# EAGLE board 2d (EAGLE 6.4)
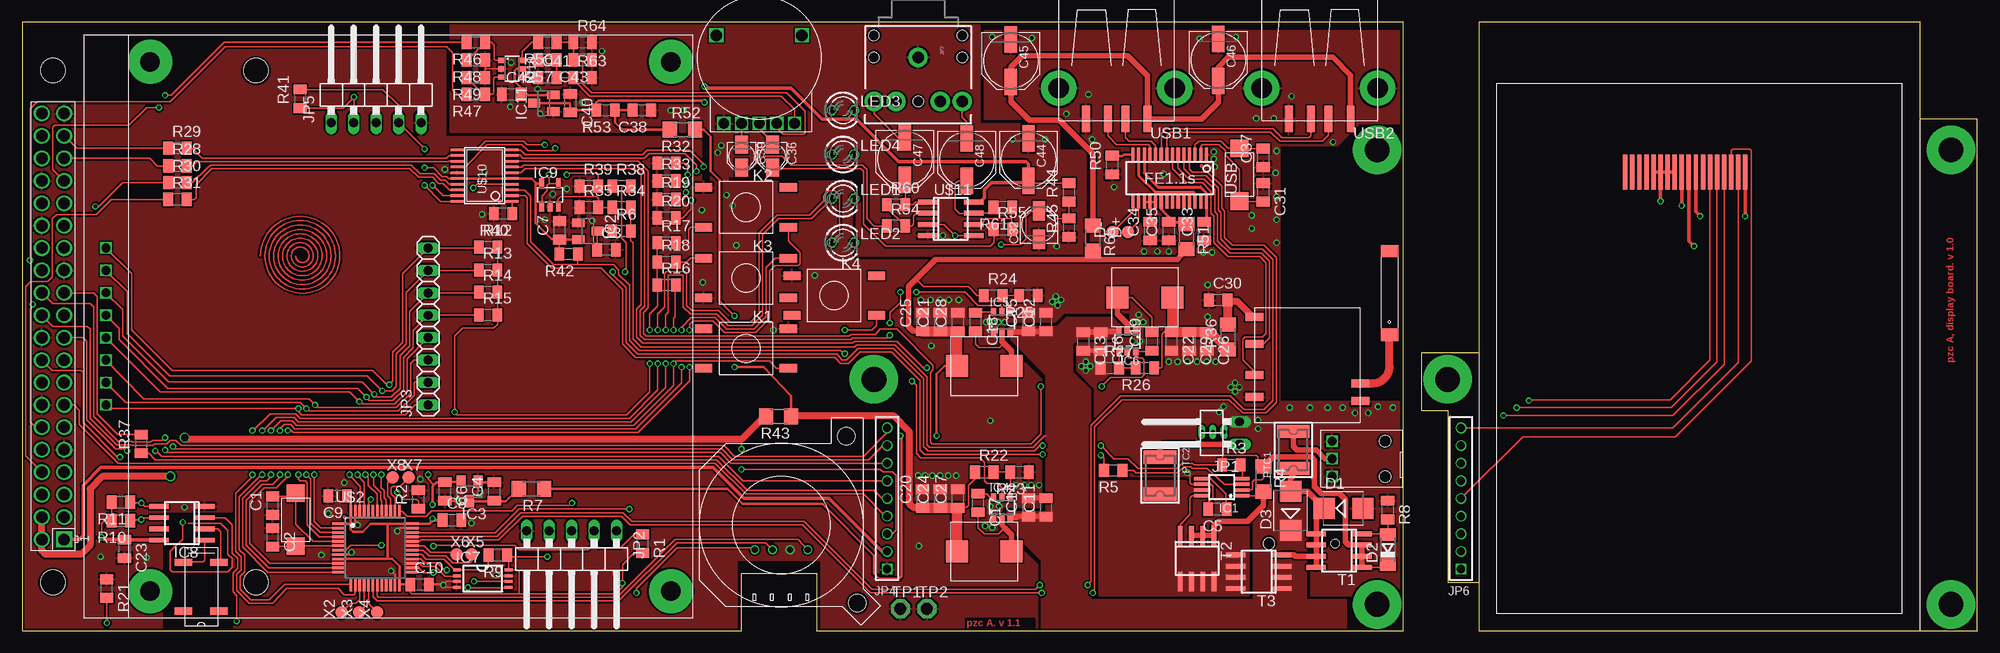
[diagram p1: board, top side]
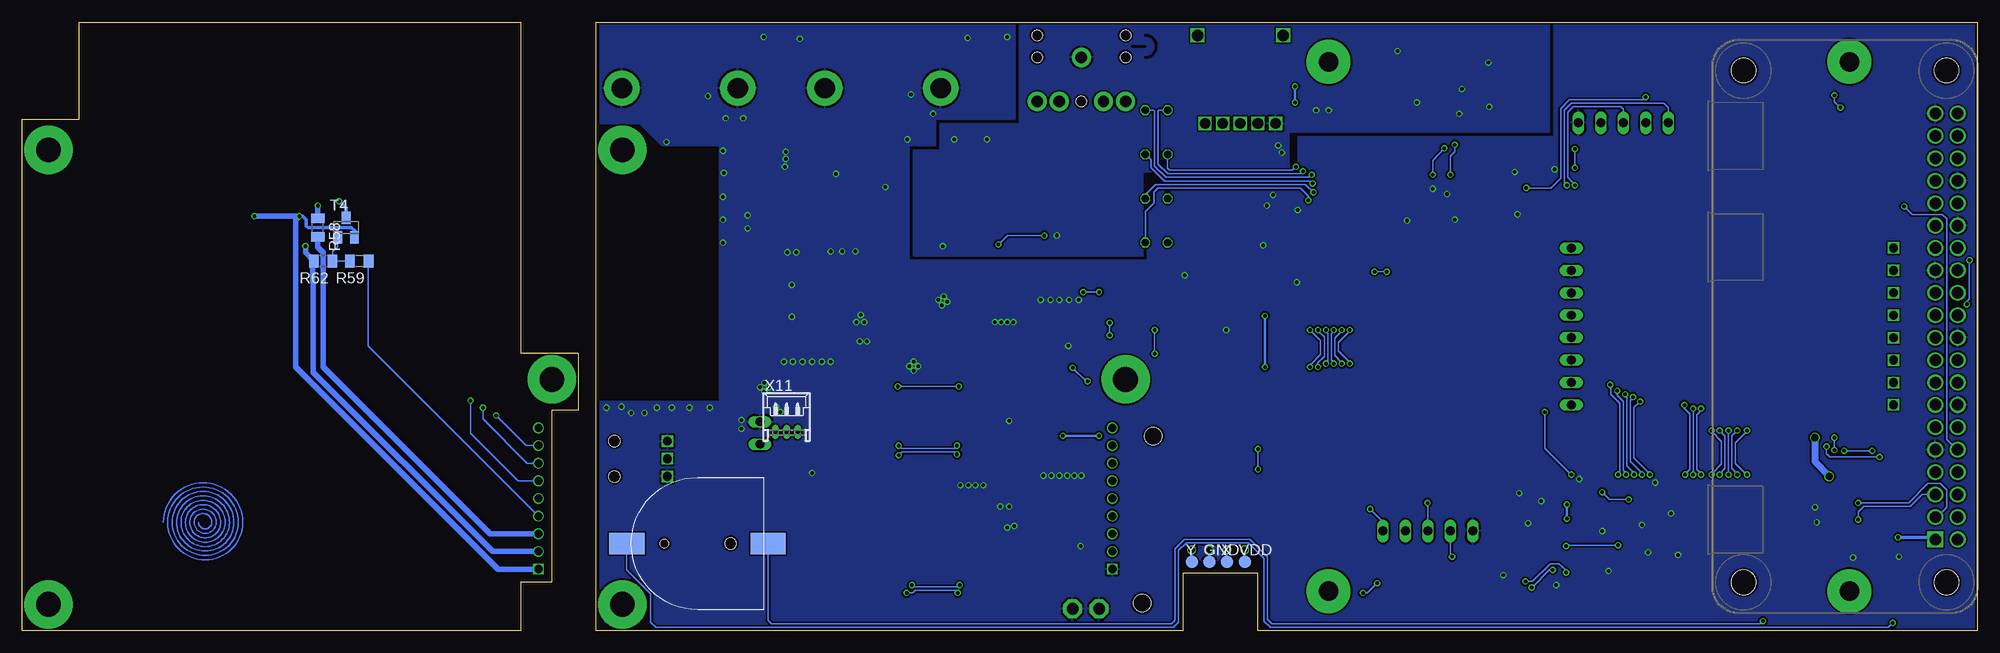
[diagram p2: board, bottom side, seen from below]

Size 221.5 x 69 mm. Coordinates in mm from the lower left corner, seen from the top.
Outline: 0,0 81.5,0 81.5,6.5 90,6.5 90,0 156.5,0 156.5,69 0,69 0,0
Outline: 161.5,5.5 165,5.5 165,0 221.5,0 221.5,58 215,58 215,69 165,69 165,31.5 158.5,31.5 158.5,25 161.5,25 161.5,5.5
Copper layers (1*16): Top 0.035mm / dielectric 1.5mm / Bottom 0.035mm
Design rules "ch_6": minimum track width 0.15mm, minimum drill 0.4mm, track to track 0.2mm, track to pad 0.2mm, pad to pad 0.2mm, via to via 0.2mm, smd to smd 0.2mm, copper to edge 10mil, drill to drill 8mil, minimum pad ring 0.15mm, minimum via ring 0.15mm, stop-mask expansion 4mil, vias tented up to drill 0mil, thermal gap 10mil
bRestrict: 2 lines

## Footprints (pad centres in the part's own frame; a part is rotated, then mirrored left to right if it is on the bottom)
ANT_RAINSUN-24G = smd 2 x 1.4: 1 0,-4.75; 2 0,4.75
R0805 = smd 1.1 x 1.5: 1 -1.05,0; 2 1.05,0
PANASONIC_B = smd 2.2 x 1.4: + 1.6,0; - -1.6,0
PANASONIC_A = smd 2 x 1.5: + 1.3,0; - -1.3,0
PANASONIC_D = smd 3 x 1.4: + 2.4,0; - -2.4,0
SMB = smd 2.4 x 2.4: A 2.2,0; C -2.2,0
SOD80C = smd 1.4 x 1.8: A 1.7,0; C -1.7,0
TP14R = smd 1.4 x 1.4: TP 0,0
MSOP8 = smd 0.4 x 1.6: 1 -0.975,-2.35; 2 -0.325,-2.35; 3 0.325,-2.35; 4 0.975,-2.35; 5 0.975,2.35; 6 0.325,2.35; 7 -0.325,2.35; 8 -0.975,2.35
SOT23 = smd 1 x 1.4: 1 -0.95,-1.1; 2 0.95,-1.1; 3 0,1.1
SOT23-6 = smd 0.6 x 0.9: 1 -0.95,-1.15; 2 0,-1.15; 3 0.95,-1.15; 4 0.95,1.15; 5 0,1.15; 6 -0.95,1.15
TSSOP8W = smd 0.9 x 0.35: 1 -3.045,1.205; 2 -3.045,0.555; 3 -3.045,-0.095; 4 -3.045,-0.745; 5 2.805,-0.745; 6 2.805,-0.095; 7 2.805,0.555; 8 2.805,1.205
SO-08 = smd 0.55 x 2.2: 1 -1.905,-2.6; 2 -0.635,-2.6; 3 0.635,-2.6; 4 1.905,-2.6; 5 1.905,2.6; 6 0.635,2.6; 7 -0.635,2.6; 8 -1.905,2.6
SOT23-5L = smd 0.55 x 1.2: 1 -0.95,-1.3; 2 0,-1.3; 3 0.95,-1.3; 4 0.95,1.3; 5 -0.95,1.3
1X02/90 = drill 1 long: 1 -2.54,-3.81; 2 0,-3.81
1X05/90 = drill 1.016 long: 1 -5.08,-3.81; 2 -2.54,-3.81; 3 0,-3.81; 4 2.54,-3.81; 5 5.08,-3.81
1X08 = drill 1.016 long: 1 -8.89,0; 2 -6.35,0; 3 -3.81,0; 4 -1.27,0; 5 1.27,0; 6 3.81,0; 7 6.35,0; 8 8.89,0
1X09M = drill 0.914 square: 1 -8,0 | drill 0.914: 2 -6,0; 3 -4,0; 4 -2,0; 5 0,0; 6 2,0; 7 4,0; 8 6,0; 9 8,0
AUDIO-JACK = drill 1.3 pad 2.184: RING 5,5; RSH 5,2.5; SLEEVE 0,0; TIP 5,-5; TSH 5,-2.5 | hole 1.2: 0,5; -2.5,5; -2.5,-5; 0,-5; 5,0
SW_SMD2 = smd 1.93 x 0.965: 1A -4.8,2.25; 1B -4.8,-2.25; 2A 4.8,2.25; 2B 4.8,-2.25
LED3MM = drill 0.813 octagon: A -1.27,0; K 1.27,0
MOD_USB_RTL8188 = smd 2 x 0.9: 3V3 12,-11.98; ANT 0,-4.45; D+ 12,-5.425; D- 12,-8.9; GND 12,-2.903; RFGND 0,-2.45
PTC1812 = smd 1.5 x 3.7: P$1 -2.1,0; P$2 2.1,0
CRYST_32K_87X38MM = smd 0.8 x 2: 1 -2.75,-2; 2 2.75,-2; 3 2.75,2; 4 -2.75,2
R1206 = smd 1.6 x 1.803: 1 -1.422,0; 2 1.422,0
DISP_ILI_28 = smd 0.5 x 4: 1 -5.2,17; 2 -4.4,17; 3 -3.6,17; 4 -2.8,17; 5 -2,17; 6 -1.2,17; 7 -0.4,17; 8 0.4,17; 9 1.2,17; 10 2,17; 11 2.8,17; 12 3.6,17; 13 4.4,17; 14 5.2,17; 15 6,17; 16 6.8,17; 17 7.6,17; 18 8.4,17
P1-13 = drill 1.321 pad 2.159 octagon: TP 0,0
CON_DC13 = drill 1 square: 1 8,3.2; 2 8,1.2; 3 8,5.2 | hole 1.3: 2,5.2; 2,1.2
LQFP48 = smd 1.5 x 0.3: 1 -4.15,2.75; 2 -4.15,2.25; 3 -4.15,1.75; 4 -4.15,1.25; 5 -4.15,0.75; 6 -4.15,0.25; 7 -4.15,-0.25; 8 -4.15,-0.75; 9 -4.15,-1.25; 10 -4.15,-1.75; 11 -4.15,-2.25; 12 -4.15,-2.75; 25 4.15,-2.75; 26 4.15,-2.25; 27 4.15,-1.75; 28 4.15,-1.25; 29 4.15,-0.75; 30 4.15,-0.25; 31 4.15,0.25; 32 4.15,0.75; 33 4.15,1.25; 34 4.15,1.75; 35 4.15,2.25; 36 4.15,2.75 | smd 0.3 x 1.5: 13 -2.75,-4.15; 14 -2.25,-4.15; 15 -1.75,-4.15; 16 -1.25,-4.15; 17 -0.75,-4.15; 18 -0.25,-4.15; 19 0.25,-4.15; 20 0.75,-4.15; 21 1.25,-4.15; 22 1.75,-4.15; 23 2.25,-4.15; 24 2.75,-4.15; 37 2.75,4.15; 38 2.25,4.15; 39 1.75,4.15; 40 1.25,4.15; 41 0.75,4.15; 42 0.25,4.15; 43 -0.25,4.15; 44 -0.75,4.15; 45 -1.25,4.15; 46 -1.75,4.15; 47 -2.25,4.15; 48 -2.75,4.15
BOURNS_SRP7030 = smd 2.5 x 2.5: P$1 3.1,0; P$2 -3.1,0
BATT_HOLDER_DS1092-12 = smd 4 x 2.4: N -8,0; POS 8,0 | hole 1: -3.75,0 | hole 1.3: 3.75,0
KB1604 = drill 1 square: 1 -8.89,-2.5; 2 -6.35,-2.5; 3 -3.81,-2.5; 4 -1.27,-2.5; 5 1.27,-2.5; 6 3.81,-2.5; 7 6.35,-2.5; 8 8.89,-2.5 | drill 2.2 pad 5: P$2 -30,2.5; P$3 30,2.5; P$4 -30,61.5; P$5 30,61.5
JOY_PS = hole 2: 10.09,-7.35; -8.85,-8.61
RASPBERRYPI_BASTELSTUBE_V13_RASPI_BOARD_B+_FULL = drill 1.3 pad 1.778 square: 1 8.37,25.23 | drill 1.3 pad 1.778: 2 8.37,27.77; 3 10.91,25.23; 4 10.91,27.77; 5 13.45,25.23; 6 13.45,27.77; 7 15.99,25.23; 8 15.99,27.77; 9 18.53,25.23; 10 18.53,27.77; 11 21.07,25.23; 12 21.07,27.77; 13 23.61,25.23; 14 23.61,27.77; 15 26.15,25.23; 16 26.15,27.77; 17 28.69,25.23; 18 28.69,27.77; 19 31.23,25.23; 20 31.23,27.77; 21 33.77,25.23; 22 33.77,27.77; 23 36.31,25.23; 24 36.31,27.77; 25 38.85,25.23; 26 38.85,27.77; 27 41.39,25.23; 28 41.39,27.77; 29 43.93,25.23; 30 43.93,27.77; 31 46.47,25.23; 32 46.47,27.77; 33 49.01,25.23; 34 49.01,27.77; 35 51.55,25.23; 36 51.55,27.77; 37 54.09,25.23; 38 54.09,27.77; 39 56.63,25.23; 40 56.63,27.77 | hole 2.8: 3.5,3.5; 3.5,26.5; 61.5,3.5; 61.5,26.5
TSSOP20 = smd 0.3 x 1.5: 1 -2.925,-3.118; 2 -2.275,-3.118; 3 -1.625,-3.118; 4 -0.975,-3.118; 5 -0.325,-3.118; 6 0.325,-3.118; 7 0.975,-3.118; 8 1.625,-3.118; 9 2.275,-3.118; 10 2.925,-3.118; 11 2.925,3.118; 12 2.275,3.118; 13 1.625,3.118; 14 0.975,3.118; 15 0.325,3.118; 16 -0.325,3.118; 17 -0.975,3.118; 18 -1.625,3.118; 19 -2.275,3.118; 20 -2.925,3.118
POT_14X2DUAL = drill 1.2 square: G -4,-7.5; T1 4,-7.5; T2 2,-7.5; W1 -2,-7.5; W2 0,-7.5 | drill 1.3 square: P$1 -4.85,2.5; P$2 4.85,2.5
FE1.1S_SSOP-28 = smd 0.35 x 1.5: 1 -4.16,-2.7; 2 -3.52,-2.7; 3 -2.88,-2.7; 4 -2.24,-2.7; 5 -1.6,-2.7; 6 -0.96,-2.7; 7 -0.32,-2.7; 8 0.32,-2.7; 9 0.96,-2.7; 10 1.6,-2.7; 11 2.24,-2.7; 12 2.88,-2.7; 13 3.52,-2.7; 14 4.16,-2.7; 15 4.16,2.7; 16 3.52,2.7; 17 2.88,2.7; 18 2.24,2.7; 19 1.6,2.7; 20 0.96,2.7; 21 0.32,2.7; 22 -0.3,2.7; 23 -0.96,2.7; 24 -1.6,2.7; 25 -2.24,2.7; 26 -2.88,2.7; 27 -3.52,2.7; 28 -4.16,2.7
USB-A-S = smd 3 x 0.9: D+ 3.45,-1; D- 3.45,1; GND 3.45,-3.5; VBUS 3.45,3.5 | drill 2.3 pad 4: GND@1 0,6.566; GND@2 0,-6.566
CR_12SMXA_S = smd 2 x 2: P$1 -3,0; P$2 3,0
53048-03 = drill 0.5 pad 0.698 long: 1 1.25,-1.25; 2 0,-1.25; 3 -1.25,-1.25

## Placement (x,y rotation side)
ANT1  ANT_RAINSUN_24GHZ  [ANT_RAINSUN-24G]  154.9,38.3 0 top
C1  33  [R0805]  28.4,14.2 90 top
C2  33  [R0805]  28.4,10.6 270 top
C3  1u  [R0805]  66.2,43.2 0 top
C4  1u  [R0805]  53.5,15.8 90 top
C5  100n  [R0805]  135.4,13.8 180 top
C6  1u  [R0805]  47.9,15.8 270 top
C7  1u  [R0805]  60.9,45.4 90 top
C8  100n  [R0805]  48.7,12.55 0 top
C9  100n  [R0805]  35.75,15.3 180 top
C10  100n  [R0805]  45.05,5.25 0 top
C11  22u  [R0805]  116,14 90 top
C12  22u  [R0805]  116,35 90 top
C13  22u  [R0805]  120.2,32.8 270 top
C14  22u  [R0805]  114,14 90 top
C15  22u  [R0805]  114,35 90 top
C16  22u  [R0805]  122.2,32.8 270 top
C17  100n  [R0805]  108.3,14.5 270 top
C18  100n  [R0805]  108,35 270 top
C19  100n  [R0805]  128,32.8 90 top
C20  22u  [R0805]  102,15 90 top
C21  22u  [R0805]  104,35 90 top
C22  22u  [R0805]  130.2,32.8 270 top
C23  100n  [R0805]  11.6,9.3 270 top
C24  22u  [R0805]  104,15 90 top
C25  22u  [R0805]  102,35 90 top
C26  22u  [R0805]  134.2,32.8 270 top
C27  22u  [R0805]  106,15 90 top
C28  22u  [R0805]  106,35 90 top
C29  22u  [R0805]  132.2,32.8 270 top
C30  22u  [R0805]  135.5,37.5 0 top
C31  33  [R0805]  140.6,49.7 270 top
C32  10u  [PANASONIC_B]  115.2,46 90 top
C33  10u  [R0805]  133.9,45.3 90 top
C34  10u  [R0805]  127.8,45.3 90 top
C35  10u  [R0805]  129.9,45.3 90 top
C36  1u  [PANASONIC_A]  85,53.8 270 top
C37  33  [R0805]  140.6,53.6 90 top
C38  10u  [R0805]  70.2,59 180 top
C39  1u  [PANASONIC_A]  81.5,53.8 270 top
C40  10u  [R0805]  62.1,59.8 270 top
C41  33n  [R0805]  59.5,62.7 0 top
C42  10u  [R0805]  55.4,60.8 0 top
C43  33n  [R0805]  63.5,64.7 180 top
C44  100u  [PANASONIC_D]  114,53.4 270 top
C45  100u  [PANASONIC_D]  112,64.6 270 top
C46  100u  [PANASONIC_D]  135.5,64.7 270 top
C47  100u  [PANASONIC_D]  100,53.5 270 top
C48  100u  [PANASONIC_D]  107,53.4 270 top
D1  12V  [SMB]  149.7,13.9 0 top
D2  12V  [SOD80C]  154.7,9.2 90 top
D3  1N5818  [SMB]  143.7,13.6 90 top
D+  TPTP14R  [TP14R]  125.3,45.2 90 top
D-  TPTP14R  [TP14R]  123.5,45.2 90 top
GND  TPTP14R  [TP14R]  87,7.8 0 bottom
IC1  MCP73844  [MSOP8]  135.9,16.3 90 top
IC2  MCP1702-SOT23  [SOT23]  64.1,45.3 270 top
IC3  MCP1702-SOT23  [SOT23]  50.7,15.8 180 top
IC4  TPS562200  [SOT23-6]  111,14 0 top
IC5  TPS562200  [SOT23-6]  111,35 0 top
IC6  TPS562200  [SOT23-6]  125.2,32.8 180 top
IC7  EEPROM_SPI-TSSOP  [TSSOP8W]  52.3,5.7 0 top
IC8  PCF8523  [SO-08]  18.1,12.2 90 top
IC9  MCP6021  [SOT23-5L]  59.8,49.4 0 top
IC10  74LVC2G34  [SOT23-6]  55.5,63.7 270 top
IC11  MCP1702-SOT23  [SOT23]  59.1,59.8 90 top
JP1  [1X02/90]  134.1,23.7 90 top
JP2  [1X05/90]  62.25,7.5 180 top
JP3  [1X08]  46,34.5 90 top
JP4  [1X09M]  98,15 90 top
JP5  [1X05/90]  40.1,61.4 0 top
JP6  [1X09M]  163,15 90 top
JP7  [AUDIO-JACK]  101.5,65 270 top
K1  SWITCH_BD_B  [SW_SMD2]  82,32 180 top
K2  SWITCH_BD_B  [SW_SMD2]  82,48 180 top
K3  SWITCH_BD_B  [SW_SMD2]  82,40 180 top
K4  SWITCH_BD_B  [SW_SMD2]  92,38 180 top
LED1  [LED3MM]  93,49 0 top
LED2  [LED3MM]  93,44 0 top
LED3  [LED3MM]  93,59 0 top
LED4  [LED3MM]  93,54 0 top
MOD1  MOD_USB_RTL8188  [MOD_USB_RTL8188]  151.6,23.6 180 top
PTC1  1,1A  [PTC1812]  144,20.5 90 top
PTC2  1,1A  [PTC1812]  128.9,17.6 270 top
Q1  CRYSTAL87X38  [CRYST_32K_87X38MM]  20.3,5 270 top
R1  10k  [R0805]  70.3,9.9 270 top
R2  10k  [R0805]  44.9,14.9 90 top
R3  10k  [R0805]  137,18.8 0 top
R4  0R47  [R1206]  140.6,17.2 270 top
R5  2k7  [R0805]  123.6,18.2 180 top
R6  1R  [R0805]  67.9,45.3 0 top
R7  0R1  [R1206]  57.7,16.1 180 top
R8  2k7  [R0805]  154.7,13.7 270 top
R9  10k  [R0805]  53.9,8.6 180 top
R10  10k  [R0805]  11.2,12.5 180 top
R11  10k  [R0805]  11.2,14.6 180 top
R12  10k  [R0805]  52.8,43.5 0 top
R13  10k  [R0805]  52.8,40.9 0 top
R14  10k  [R0805]  52.8,38.4 0 top
R15  10k  [R0805]  52.8,35.8 0 top
R16  10k  [R0805]  73,39.2 0 top
R17  10k  [R0805]  73,44 0 top
R18  10k  [R0805]  73,41.8 0 top
R19  470  [R0805]  73,48.9 0 top
R20  470  [R0805]  73,46.8 0 top
R21  0R  [R0805]  9.6,4.8 270 top
R22  56k  [R0805]  109,18 0 top
R23  10k  [R0805]  113,18 180 top
R24  56k  [R0805]  110,38 0 top
R25  10k  [R0805]  114,38 180 top
R26  33k  [R0805]  127.2,29.8 180 top
R27  10k  [R0805]  123.2,29.8 0 top
R28  470  [R0805]  17.6,52.7 0 top
R29  470  [R0805]  17.6,54.7 0 top
R30  470  [R0805]  17.6,50.8 0 top
R31  470  [R0805]  17.6,48.9 0 top
R32  470  [R0805]  73,53 0 top
R33  470  [R0805]  73,51 0 top
R34  10M  [R0805]  67.9,48 0 top
R35  1M  [R0805]  64.2,48 0 top
R36  0R1  [R1206]  136.6,33.3 90 top
R37  47  [R0805]  13.5,21.2 90 top
R38  56k  [R0805]  67.9,50.4 0 top
R39  10k  [R0805]  64.2,50.4 0 top
R40  10k  [R0805]  54.5,47.3 180 top
R41  10k  [R0805]  31.5,60.3 90 top
R42  10k  [R0805]  61.9,42.7 180 top
R43  0R1  [R1206]  85.7,24.3 180 top
R44  10k  [R0805]  118.6,49.7 90 top
R45  10k  [R0805]  118.6,45.7 90 top
R46  470  [R0805]  51.4,66.7 180 top
R47  470  [R0805]  51.4,60.8 180 top
R48  10k  [R0805]  51.4,64.7 180 top
R49  10k  [R0805]  51.4,62.7 180 top
R50  2k7  [R0805]  123.5,52.8 90 top
R51  0R1  [R1206]  131.9,44.7 270 top
R52  0R1  [R1206]  74.8,56.8 0 top
R53  47R  [R0805]  66.1,59 180 top
R54  10k  [R0805]  99,45.9 0 top
R55  10k  [R0805]  111.1,45.5 0 top
R56  270  [R0805]  59.5,66.7 180 top
R57  270  [R0805]  59.5,64.7 180 top
R58  47  [R0805]  188,45.7 270 bottom
R59  270  [R0805]  183.3,41.9 180 bottom
R60  10k  [R0805]  99,48.3 0 top
R61  10k  [R0805]  111.1,48 180 top
R62  10k  [R0805]  187.4,41.9 180 bottom
R63  150  [R0805]  63.5,62.7 0 top
R64  150  [R0805]  63.5,66.7 0 top
R65  0R1  [R1206]  121.3,44.5 270 top
T1  PFET_SO8  [SO-08]  149.2,9.1 90 top
T2  PFET_SO8  [SO-08]  133.1,8.2 180 top
T3  PFET_SO8  [SO-08]  140.1,6.7 90 top
T4  BC847  [SOT23]  184.8,45.7 0 bottom
TFT1  DISP_ILI_28  [DISP_ILI_28]  190,69 180 top
TP1  PTR1PAD1-13  [P1-13]  99.5,2.5 0 top
TP2  PTR1PAD1-13  [P1-13]  102.5,2.5 0 top
U$1  CONN_DC_13  [CON_DC13]  156.4,22.7 180 top
U$2  STM32F072-LQFP48  [LQFP48]  40,9.4 0 top
U$3  2u2  [BOURNS_SRP7030]  109,9 0 top
U$4  2u2  [BOURNS_SRP7030]  109,30 0 top
U$5  2u2  [BOURNS_SRP7030]  127.2,37.8 180 top
U$6  BATTH1220  [BATT_HOLDER_DS1092-12]  145,9.9 0 bottom
U$7  KB1604  [KB1604]  12,34.5 270 top
U$8  JOY_PS  [JOY_PS]  86,12 90 top
U$9  RPI-ZERO  [RASPBERRYPI_BASTELSTUBE_V13_RASPI_BOARD_B+_FULL]  30,2 90 top
U$10  STM32F030_20  [TSSOP20]  52.4,51.6 90 top
U$11  TDA1308  [SO-08]  105.2,46.7 270 top
U$12  POT_DUAL_14X2  [POT_14X2DUAL]  83.5,65 0 top
USB  FE1.1S  [FE1.1S_SSOP-28]  130,51.3 180 top
USB1  USB-A-S  [USB-A-S]  124,61.5 270 top
USB2  USB-A-S  [USB-A-S]  147,61.5 270 top
VDD  TPTP14R  [TP14R]  83,7.8 0 bottom
X  TPTP14R  [TP14R]  85,7.8 0 bottom
X1  CRYST_TC26SMXAS  [CR_12SMXA_S]  31,12.6 270 top
X2  TPTP14R  [TP14R]  36.2,2.1 90 top
X3  TPTP14R  [TP14R]  38.2,2.1 90 top
X4  TPTP14R  [TP14R]  40.2,2.1 90 top
X5  TPTP14R  [TP14R]  50.9,8.7 0 top
X6  TPTP14R  [TP14R]  49.2,8.7 0 top
X7  TPTP14R  [TP14R]  43.8,17.4 0 top
X8  TPTP14R  [TP14R]  42,17.4 0 top
X9  CRYST_TC26SMXAS  [CR_12SMXA_S]  137.9,51.7 90 top
X11  53048-03  [53048-03]  134.9,23.8 0 bottom
Y  TPTP14R  [TP14R]  89,7.8 0 bottom

## Tracks (layer width: path | path; a pad name or v marks a point on that pad's centre or on a via)
3V3_EN  (via drill 0.4)
  Top 0.16: U$10.8 69.78,53.23 70.9,52.1 70.9,36.6 70.4,36.1 70.4,33.7 70.7,33.4 93.7,33.4 93.9,33.6 96.7,33.6 97.2,34.2 99.1,34.2 103.2,30.1 103.2,29.6 102.9,29.3 102.9,21.4 103.1,21.2 114.3,21.2 115.4,22.3 v115.4,27.7 | v122.3,27.7 123.3,28.7 126.8,28.7 127.1,29 127.1,30.7 126.9,30.9 125.4,30.9 125.2,31.1 IC6.5
  Bottom 0.16: v122.3,27.7 v115.4,27.7
3V_STB  (via drill 0.4)
  Top 0.16: 58.3,50.7 58.2,50.8 | v45.6,54.6 45.6,54.63 JP5.4 42.7,57.65 42.7,59.5 40.85,61.35 R41.2 | R42.2 60.85,44.3 C7.1 60.85,44.4 | U$10.16 48.33,51.27 48.1,51.5 47.6,51.5 46.6,52.5 v45.6,52.5
  Top 0.3: U$10.16 U$10.5 57.73,51.27 58.2,50.8 58.2,46.2 60,44.4 60.85,44.4 | IC9.5 58.3,50.7 | C7.1 IC2.2
  Bottom 0.16: v45.6,52.5 v45.6,54.6
5V0@2  (via drill 0.4, 0.8)
  Top 0.16: JP4.3 98.6,11 99,11.4 99,17.6 98.6,18 97.5,18 97.2,18.3 v81.5,18.3 | v81.5,20.6 81.5,21.7
  Top 0.8: R43.2 84.1,24.3 81.5,21.7 18.6,21.7 v18.4,21.9 | v16.8,17.5 9.1,17.5 7.7,16.1 7.7,9.7 6.7,8.7 2.6,8.7 2.2,9.1 2.2,10.34 U$9.2 U$9.4
  Bottom 0.16: v81.5,18.3 v81.5,20.6
  Bottom 0.8: v18.4,21.9 18.4,19.2 v16.8,17.5
5VM_EN  (via drill 0.4)
  Top 0.16: U$10.6 56.52,51.92 57,52.4 69.4,52.4 70.1,51.7 70.1,37 69.6,36.5 69.6,33.3 70.3,32.6 94.1,32.6 94.3,32.8 99.1,32.8 102.3,29.6 v102.5,29.8 | IC4.5 111,16.2 110.5,16.7 109.3,16.7 109,17 109,19.1 108.5,19.6 101.8,19.6 101.3,20.1 101.3,27.8 v100.8,28.3
  Bottom 0.16: v100.8,28.3 101,28.3 v102.5,29.8
5VU_EN  (via drill 0.4)
  Top 0.16: U$10.7 56.58,52.58 56.8,52.8 69.6,52.8 70.5,51.9 70.5,36.8 70,36.3 70,33.5 70.5,33 93.9,33 94.1,33.2 98,33.2 v98.3,33.5 | IC5.5 111,36.7 110.8,36.9 108.3,36.9 106.8,38.4 v101.3,38.4 | v99.5,38.4 99.5,37.2 98.3,36.1 v98.3,34.9
  Bottom 0.16: v101.3,38.4 v99.5,38.4 | v98.3,33.5 v98.3,34.9
+3V3
  Top 0.16: C22.1 129.35,33.85 129.1,33.6 129.1,29.9 129,29.8 R26.1
  Top 0.6: 130.3,33.95 C22.1 | C26.1 134.63,33.85
  Top 1: 134.63,33.85 R36.1
  Top 1.2: U$5.P$2 130.3,33.95 | C22.1 C29.1 C26.1
+5V  (via drill 0.4)
  Top 0.16: R22.1 107.95,17.25 107.2,16.5 107.2,14.2 107,14 106.05,14 C27.1
  Top 0.3: v80.7,35.7 79,37.4 79,51.1 78,52.1 78,56 77.2,56.8 R52.2 | v80.7,29.9 84,29.9 87.1,26.6 87.1,24.32 R43.1
  Top 0.6: 105.9,13.85 C27.1
  Top 0.8: R43.1 87.4,24.3 87.5,24.4 98.7,24.4 100.5,22.6 100.5,14.4 100.9,14 101.95,14 C20.1
  Top 1.2: U$3.P$2 105.9,13.85 | C27.1 C24.1 C20.1
  Bottom 0.3: v80.7,35.7 v80.7,29.9
+5V/1  (via drill 0.4)
  Top 0.16: R24.1 108.2,38 107.2,39 102.1,39 101.25,39.85
  Top 0.3: R7.1 79.9,16.1 81.6,14.4 90.7,14.4 96.5,8.5 96.5,6.5 97.1,5.9 99.3,5.9 99.6,6.2 99.6,21.9 v99.5,22.1 | v103.6,22.1 103.6,29.1 104.5,30 U$4.P$2
  Top 0.6: R65.2 121.3,42.1 | 121.3,42.1 103.5,42.1 101.25,39.85 100.4,39 100.4,34.5 100.9,34 101.95,34 C25.1 | 105.9,33.85 C28.1 | R51.2 131.88,43.28 130.9,42.1 121.3,42.1
  Top 1.2: C25.1 C21.1 C28.1 | U$4.P$2 105.9,33.85
  Bottom 0.3: v99.5,22.1 v103.6,22.1
+8V
  Top 0.16: R34.2 R6.2 68.95,44.25 69.2,44 69.2,33.4 69.2,33.1 70.1,32.2 70.4,32.2 94.3,32.2 94.5,32.4 98.9,32.4 102.5,28.8 102.5,21.1 102.8,20.8 114.5,20.8 115.8,22.1 116,22.1
  Top 0.6: IC4.3 112.65,12.85 112.8,13 113.95,13 C14.1 C11.1 | IC6.3 122.3,33.95 C16.1 C13.1 | IC5.3 113.9,33.85 C15.1 C12.1
  pour Top (no thermals): 115.5,0 150,0 150,3.5 145.5,3.5 145.5,16 139.5,16 139.5,3.5 121,3.5 121,27.3 119,29.3 119,32.5 119.6,33.1 124.1,33.1 124.5,33.5 124.5,34.5 123.5,35.5 118.3,35.5 117.3,34.5 112,34.5 112,33 116,29 116,13.5 111.5,13.5 111.5,12 115.5,8
+12V  (via drill 0.4)
  Top 0.16: T1.1 154.4,7.2 D2.C | R38.2 68.1,50.4 67.9,50.2 67.9,44.5 68.4,44 68.4,40.9 v68.3,40.7 | v115.6,21 115.3,21 114.7,20.4 102.6,20.4 102.1,20.9 102.1,28.6 98.7,32 94.7,32 93.4,30.7 92.9,30.7 92.3,31.4 69.7,31.4 68.4,32.7 68.4,38.9 66.9,40.4 v66.9,40.7 | v122.2,21 123.7,19.5 125.3,19.5 126.4,18.4 130.8,18.4 131.4,19 132.6,19 132.8,18.8 R3.1 135.95,19.75 136.1,19.9 139.8,19.9 140,19.7 140,19.22 R4.1 140.6,17.3 140.4,17.1 139.6,17.1 139.4,16.9 139.4,16.1 139.28,15.97 IC1.2
  Top 0.6: T1.1 T1.2 T1.3 150.26,9.73 149.9,10.1 149.9,14.9 149.2,15.6 147.2,15.6 146.4,16.4 146.4,19.4 146.1,19.7 141.68,19.7 R4.1
  Bottom 0.16: v68.3,40.7 v66.9,40.7 | v122.2,21 121.9,20.7 115.9,20.7 v115.6,21
ADC1  (via drill 0.4)
  Top 0.16: U$10.11 51.52,54.52 52.5,55.5 56.8,55.5 57.2,55.1 v59.2,55.1 | IC9.1 58.9,48.15 58.9,49.3 59.5,49.9 59.5,50.5 59.7,50.7 | 59.7,50.7 IC9.4 | v59.7,51.7 59.7,50.7
  Bottom 0.16: v59.2,55.1 59.2,54.3 59.7,53.8 v59.7,51.7
ADC2  (via drill 0.4)
  Top 0.16: v61.7,51.7 61.9,51.9 65,51.9 65.25,51.65 R39.2 R38.1 | v60.4,54.7 60.1,54.4 57.3,54.4 56.6,55.1 52.7,55.1 50.17,52.58 U$10.14
  Bottom 0.16: v61.7,51.7 61.7,53.3 v60.4,54.7
BKLT
  Top 0.16: JP4.4 97.8,13 95.3,15.5 82,15.5 78.5,19 10.9,19 6.5,23.4 6.5,25 5.89,25.61 U$9.13
BSTAT  (via drill 0.4)
  Top 0.16: U$10.2 56.98,49.33 57.2,49.1 57.2,43.9 60,41.1 65.6,41.1 68,38.7 68,32.5 69.5,31 92.1,31 92.7,30.3 93.6,30.3 94.9,31.6 98.5,31.6 101.7,28.4 101.7,20.5 102.2,20 v115.6,20 | R5.2 122.55,19.55 v122.2,19.9
  Bottom 0.16: v122.2,19.9 121.8,20.3 115.9,20.3 v115.6,20
CS  (via drill 0.4)
  Top 0.16: JP4.7 80.3,19 79.1,20.2 16.4,20.2 v16.2,20.5 | U$9.24 2.29,38.31 3.5,37.1 7.7,37.1 8.1,36.7 8.1,24.3 10.9,21.5 12.4,21.5 12.5,21.4 14.6,21.4 14.8,21.6 15.9,21.6 v16.2,21.9
  Bottom 0.16: v16.2,20.5 v16.2,21.9
D+
  Top 0.16: USB.16 126.48,46.38 D+.TP
D-
  Top 0.16: USB.15 125.84,47.54 D-.TP
D/C  (via drill 0.4)
  Top 0.16: JP4.8 97.5,21 95.9,19.4 80.5,19.4 79.3,20.6 17.4,20.6 v17.1,20.9 | U$9.18 2.23,30.67 3.4,29.5 6.7,29.5 6.9,29.3 6.9,23.6 10.8,19.7 v11.1,19.7
  Bottom 0.16: v17.1,20.9 17.1,20.1 16.7,19.7 v11.1,19.7
GND  (via drill 0.4, 0.7)
  Top 0.16: IC7.7 54.24,6.25 54,6.5 | IC7.3 48.1,5.6 v47.7,5.2 47.95,4.96 IC7.4 | IC10.2 52.5,63.7 | 52.5,63.7 52.5,64.65 R48.1 | R49.1 52.45,63.65 52.5,63.7 | 132.3,18.1 132.3,16.8 132.47,16.62 IC1.6 134.68,16.62 134.9,16.4 134.9,15.1 134.4,14.6 134.4,14.35 C5.2 | v18.2,12.3 18.2,10.4 16.8,9 16.8,6.9 17,6.7 23.3,6.7 23.8,7.2 23.8,8.2 23.3,8.7 23.3,11.4 22.5,12.2 18.8,12.2
  Top 0.3: U$2.23 42.25,6.35 v41.8,6.8 | U$2.8 37.05,8.65 v37.3,8.9 | U$2.35 42.85,11.65 v42.5,11.3 | U$2.47 37.75,12.25 v38,12 | C6.2 49.05,14.75 v49.4,14.7 | v51.9,15.6 51.65,15.85 IC3.1 51.7,16.85 C4.2 | C10.2 47.75,5.25 v47.7,5.2
  Top 0.5: C13.2 C16.2
  Top 0.6: C11.2 C14.2
  other vias: 50.9,12.2 34.7,13.3 58.4,61.4 55.4,64.4 55.3,59.4 65.7,65.7 73.5,59 58.7,58.6 104.3,44.8 112.2,55.7 117.2,43.6 63.5,59.9 52.4,52 52.1,47.2 61.7,50.1 60.1,49.5 59.2,46.6 64.6,46.5 77,47.7 127.1,43 133.8,42.9 123.7,50.3 121.2,55.7 143.8,60.6 120.8,60.8 109.9,67.3 114.4,67.2 133.4,67.1 137.5,67.3 135,54.3 135.1,52.6 136.9,27.6 132,17.9 129.9,30.5 130.9,30.5 125.8,32.8 109.9,11.7 104.9,17.6 85.1,34.1 77.1,39.5 102.9,37.5 109.9,35 116.7,37.3 114.3,16.5 87,9.2 101.6,9.6 47.9,52.3 121,30 120.5,30.5 135.6,24.8 136.1,25.4 140,22.9 140,23.9 104,17.6 103.1,17.6 102.3,17.6 101.5,17.6 105.8,17.6 110.7,14.1 109.7,14.1 109.1,11.9 113.5,16.5 112.6,16.5 115.2,16.5 110.6,35 111.3,35 109.2,35 126.6,32.8 126.1,35 127,35 126.5,35.8 120,30 120.5,29.5 132,30.5 133.1,30.5 134.2,30.5 135.2,30.5 134.3,39.2 134.3,35.6 137.4,28.1 139.3,47.1 139.3,45.6 141.8,58.1 139.8,58.1 118.3,58.6 79.8,49.4 80.5,48.2 80.9,43.7 79.2,55 135,53.5 115.9,55.7 78.8,54.2 74.9,59 89.8,40.3 109.7,23.8 103,32.3 134.8,42.9 45.1,17.2 33.9,8.6 53.7,6.3 117.7,37.5 117.3,36.9 117.1,37.9 104,37.5 137.9,27.6 137.4,27.1 149.6,25.3 151,24.7 152.5,24.7 153.6,25.4 147.9,25.3 145.9,25.3 143.6,25.3 155.3,25.3 142.1,44 142.1,46.6 142.1,49.2 142,51.9 142.1,54.4 148.5,55.4 129.3,51.8 129.9,43 128.6,43 36.5,16.8 8.9,8.4 14.1,8.3 18.4,14 105,37.5 106.1,37.5 101.8,37.5
  pour Bottom: 48.5,69 48.5,56.5 78,56.5 78,52 80,52 80,51 77,51 77,56 48,56 48,69 0,69 0,-1 81,0 81,8 90.5,8 90.5,0 156,-1 156,26 142.5,26 142.5,55 149,55 151.5,57.5 156,57.5 156,69 109,69 109,58 118,58 118,55 121,55 121,42 94,42 94,51.5 81,51.5 81,52 94.5,52 94.5,42.5 120.5,42.5 120.5,54.5 117.5,54.5 117.5,57.5 108.5,57.5 108.5,69
  pour Top: 48.5,69 48.5,56.5 78,56.5 78,51 77,51 77,56 48,56 48,69 0,69 0,0 15.9,0 15.9,13.5 24,13.5 24,0 81,0 81,8 90.5,8 90.5,0 115,0 115,7.5 111,11.5 111,14 115.5,14 115.5,28.5 111.5,32.5 111.5,35 117,35 118,36 125.5,36 125.5,33.3 124.9,33.3 124.2,32.6 119.7,32.6 119.5,32.4 119.5,29.5 121.5,27.5 121.5,17.5 140.5,17.5 140.5,16.5 146,16.5 146,4 156,4 156,26 142.5,26 142.5,55 149,55 151.5,57.5 156,57.5 156,68 109,68 109,58 118,58 118,55 121,55 121,42 94,42 94,51 80,51 80,51.5 94.5,51.5 94.5,42.5 120.5,42.5 120.5,54.5 117.5,54.5 117.5,57.5 108.5,57.5 108.5,69
  pour Top (no thermals): 113,16 113,14 115.5,14 115.5,16
  pour Top (no thermals): 101,17 101,15 107,15 107,17
  pour Top (no thermals): 101,37 101,35 107,35 107,37
  pour Top (no thermals): 129.5,32.5 129.5,30.5 135.5,30.5 135.5,32.5
  pour Top (no thermals): 112.5,36.9 112.5,35 117,35 117,36.9
  pour Top (no thermals): 119.5,32.3 119.5,30 121,28.5 123.2,28.5 123.3,32.6 119.7,32.6
  pour Top (no thermals): 126,35 126,33 127,33 127,35
  pour Top (no thermals): 109.5,35 109.5,33 110.5,33 110.5,35
  pour Top (no thermals): 109.5,13.5 109.5,11.5 110.5,11.5 110.5,13.5
  pour Top (no thermals): 135.6,22.5 139.8,22.5 139.8,24.9 135.6,24.9
JX  (via drill 0.7)
  Top 0.16: U$2.18 39.75,3.85 40.2,3.4 67.6,3.4 74.2,10 84.2,10 v85,9.2
  Bottom 0.16: v85,9.2 X.TP
JY  (via drill 0.7)
  Top 0.16: U$2.19 40.25,3.95 40.4,3.8 67.4,3.8 74,10.4 87.9,10.4 v89,9.2
  Bottom 0.16: v89,9.2 Y.TP
KC1  (via drill 0.4)
  Top 0.16: R12.1 51.64,43.39 JP3.8 43.1,40.49 43.1,32.7 42,31.6 42,28.3 v41.6,27.9 41.3,27.9 39.7,29.5 17,29.5 12.4,34.1 12.4,40.49 U$7.1 | U$2.40 41.25,14.85 41,15.1 41,15.9 40.7,16.2 v40.7,17.7
  Bottom 0.16: v40.7,17.7 40.7,17.8 40.5,18 40.5,25.8 41.5,26.8 41.5,27.8 v41.6,27.9
KC2  (via drill 0.4)
  Top 0.16: R13.1 51.7,40.85 JP3.7 43.5,38.35 43.5,32.5 42.4,31.4 42.4,27.7 41.9,27.2 v40.8,27.2 39.1,28.9 16.7,28.9 11.9,33.7 11.9,38.45 U$7.2 | U$2.41 40.75,14.75 40.6,14.9 40.6,15.7 39.8,16.5 v39.8,17.7
  Bottom 0.16: v39.8,17.7 39.8,17.9 40.1,18.2 40.1,26 40.8,26.7 v40.8,27.2
KC3  (via drill 0.4)
  Top 0.16: R14.1 51.66,38.31 JP3.6 43.9,36.21 43.9,32.3 42.8,31.2 42.8,27.5 41.8,26.5 40.1,26.5 v39.9,26.8 38.5,28.2 16.6,28.2 11.4,33.4 11.4,36.41 U$7.3 | U$2.42 40.25,14.65 40.2,14.7 40.2,15.5 39.2,16.5 39.2,17.4 v38.9,17.7
  Bottom 0.16: v38.9,17.7 38.9,17.9 39.7,18.7 39.7,26.5 39.9,26.7 v39.9,26.8
KC4  (via drill 0.4)
  Top 0.16: R15.1 51.72,35.77 JP3.5 44.3,34.07 44.3,32.1 43.2,31 43.2,27.3 42,26.1 39.3,26.1 39,26.4 v39,26.5 38,27.5 16.5,27.5 11,33 11,34.27 U$7.4 | U$2.45 38.75,16.85 38,17.6 v38,17.7
  Bottom 0.16: v38,17.7 38,17.9 39.3,19.2 39.3,26.1 39,26.4 v39,26.5
KEYB_DM  (via drill 0.4)
  Top 0.16: U$2.32 45.05,10.15 45.2,10.3 54,10.3 56.7,13 67.9,13 68.9,12 88.4,12 96.1,4.3 v115.5,4.3 | USB.4 132.24,52.36 132.6,52 134.3,52 135.9,50.4 135.9,47.9 136.2,47.6 136.2,44.6 137.1,43.7 140.7,43.7 142.1,42.3 142.1,25.9 140.9,24.7 138.3,24.7 136.7,26.2 124.6,26.2 121.5,23.1 121.5,4.5 v121.3,4.3
  Bottom 0.16: v121.3,4.3 120.6,4.3 120.3,4.6 115.8,4.6 v115.5,4.3
KEYB_DP  (via drill 0.4)
  Top 0.16: U$2.33 45.05,10.65 45.1,10.7 53.8,10.7 56.5,13.4 68.1,13.4 69.1,12.4 88.6,12.4 96.3,4.7 114.8,4.7 v115.3,5.2 | USB.5 131.6,52.4 132.4,51.6 134.1,51.6 135.5,50.2 135.5,47.7 135.8,47.4 135.8,44.4 136.9,43.3 140.5,43.3 141.7,42.1 141.7,26.1 140.7,25.1 138.4,25.1 136.9,26.6 124.4,26.6 121.1,23.3 121.1,5.6 v120.7,5.2
  Bottom 0.16: v120.7,5.2 120.6,5.2 120.4,5 115.5,5 v115.3,5.2
KL1  (via drill 0.4)
  Top 0.16: U$2.13 29.75,5.25 28,3.5 25.9,3.5 24.7,4.7 24.7,6.2 25.2,6.7 25.2,8.6 24.6,9.2 24.6,15.2 27.1,17.7 v27.2,17.7 | v27.2,22.7 27.3,22.7 28.8,24.2 30.8,24.2 31.3,23.7 69,23.7 72.9,27.6 v72.9,30.3 | v72.9,34.1 72.9,35.8 73.2,36.1 73.2,40.3 74.9,40.3 74.9,36.7 75.7,35.9 78.7,35.9 80,34.6 82.7,34.6 83.9,35.8 83.9,44.9 85.7,46.7 89.43,46.7 LED1.A
  Bottom 0.16: v27.2,17.7 27.2,17.8 27.8,18.4 27.8,22.1 v27.2,22.7 | v72.9,34.1 72.9,34 73.2,33.7 73.2,30.7 72.9,30.4 v72.9,30.3
KL2  (via drill 0.4)
  Top 0.16: U$2.14 37.75,4.25 37.6,4.1 36.5,4.1 35.8,4.8 30,4.8 28.4,3.1 25.7,3.1 24.3,4.6 24.3,6.4 24.8,6.9 24.8,8.4 24.2,9 24.2,15.6 26.1,17.5 v26.1,17.7 | v26.1,22.7 26.2,22.7 28.1,24.6 31,24.6 31.5,24.1 68.8,24.1 72,27.3 v72,30.3 | v72,34.1 72,35.9 72.8,36.7 72.8,40.5 73,40.7 75.1,40.7 75.3,40.5 75.3,36.9 75.9,36.3 78.9,36.3 80.2,35 82.5,35 83.5,36 83.5,45.1 85.5,47.1 89.2,47.1 90.8,48.7 90.8,49.3 91.4,49.9 92.1,49.9 92.6,49.4 92.6,44.87 LED2.A
  Bottom 0.16: v26.1,17.7 27.4,19 27.4,21.3 26.1,22.6 v26.1,22.7 | v72,34.1 72,34 72.8,33.2 72.8,31.2 72.1,30.5 v72,30.3
KR1  (via drill 0.4)
  Top 0.16: U$7.5 15.63,27.1 37.1,27.1 v38.2,26 38.3,26 38.6,25.7 42.2,25.7 43.6,27.1 43.6,30.83 JP3.4 | U$2.46 38.25,14.75 38.3,14.8 38.3,16.4 37.1,17.6 v37.1,17.7
  Bottom 0.16: v37.1,17.7 37.1,17.8 38.9,19.6 38.9,25.3 v38.2,26
KR2  (via drill 0.4)
  Top 0.16: U$2.2 33.85,11.65 33.1,12.4 v33.1,17.7 | U$7.6 13.79,26.3 32.5,26.3 v33.2,25.6 33.5,25.3 42.4,25.3 44,26.9 44,30.3 44.4,30.7 JP3.3
  Bottom 0.16: v33.1,17.7 33.1,17.8 32.6,18.3 32.6,24.6 33.2,25.2 v33.2,25.6
KR3  (via drill 0.4)
  Top 0.16: U$2.3 33.75,11.15 32.7,12.2 32.7,17.2 v32.2,17.7 | U$7.7 11.75,25.9 31.5,25.9 v32.2,25.2 32.5,24.9 42.6,24.9 44.4,26.7 44.4,28.1 44.5,28.2 45.95,28.2 JP3.2
  Bottom 0.16: v32.2,17.7 v32.2,25.2
KR4  (via drill 0.4)
  Top 0.16: U$2.4 33.65,10.65 32.3,12 32.3,16.8 32.1,17 31.5,17 31.3,17.2 v31.3,17.7 | U$7.8 9.6,25.6 10,25.2 v31.3,25.2 31.3,24.9 31.7,24.5 43.4,24.5 44.5,25.6 JP3.1
  Bottom 0.16: v31.3,17.7 31.3,17.8 31.8,18.3 31.8,24.5 31.3,25 v31.3,25.2
MK1  (via drill 0.4)
  Top 0.16: U$2.10 28.05,7.65 25.8,9.9 25.8,14.6 27.4,16.2 28.8,16.2 30.1,17.5 v30.1,17.7 | v30.1,22.7 30.5,22.7 30.7,22.5 69.8,22.5 75.6,28.3 v75.6,29.9 | v75.6,34.1 75.6,34.7 76,35.1 78.3,35.1 79.6,33.8 83.1,33.8 84.7,35.4 84.7,40.8 85.3,41.4 87.9,41.4 88.1,41.6 88.1,42.9 86.8,44.2 K2.1A 86.85,45.8
  Bottom 0.16: v30.1,17.7 30.1,17.8 29,18.9 29,21.5 30.1,22.6 v30.1,22.7 | v75.6,34.1 74.4,32.9 74.4,31.3 75.6,30.1 v75.6,29.9
MK2  (via drill 0.4)
  Top 0.16: U$2.11 27.95,7.15 25.4,9.7 25.4,14.8 27.2,16.6 28.4,16.6 29.2,17.4 v29.2,17.7 | v29.2,22.7 29.2,22.9 29.7,23.4 30.4,23.4 30.9,22.9 69.5,22.9 74.7,28.1 v74.7,29.9 | K3.1B 85.35,42.25 84.3,41.2 84.3,35.6 82.9,34.2 79.8,34.2 78.5,35.5 75.8,35.5 74.7,34.4 v74.7,34.1
  Bottom 0.16: v29.2,17.7 29.2,17.8 28.6,18.4 28.6,22.1 v29.2,22.7 | v74.7,34.1 74.7,34 74,33.3 74,31.1 74.7,30.4 v74.7,29.9
MK3  (via drill 0.4)
  Top 0.16: K1.1A 85.45,29.75 84.7,30.6 74.1,30.6 v73.8,30.3 73.8,27.8 69.3,23.3 31.1,23.3 30.6,23.8 29.3,23.8 v28.2,22.7 | 74.2,39.05 R16.2 74,39.15 74,35.6 73.8,35.4 v73.8,34.1 | U$2.12 27.85,6.65 25,9.5 25,15 27,17 27.7,17 28.2,17.5 v28.2,17.7
  Bottom 0.16: v28.2,17.7 v28.2,22.7 | v73.8,34.1 73.8,33.9 73.6,33.7 73.6,30.5 v73.8,30.3
N$1  (via drill 2.8 pad 5.5)
  other vias: 218.5,3
N$2
  Top 0.3: 131.67,46.35 R51.1
  Top 0.35: USB.20 129.04,47.76 129.9,46.9 C35.2 131.67,46.35
N$3
  Top 0.16: C17.2 108.3,11.7 109,11 110.6,11 111.3,11.7
  Top 0.6: IC4.2 111,12 111.3,11.7 112.1,10.9 U$3.P$1
N$4  (via drill 2.8 pad 5.5)
  other vias: 153.5,3
N$5
  Bottom 0.6: R58.2 188,43.5 187.4,42.9 187.4,29.9 168.5,11 JP6.3
N$6  (via drill 0.4)
  Top 0.16: v51.2,5.6 IC7.6 | U$2.26 44.95,7.15 45.5,6.6 v46.6,6.6
  Bottom 0.16: v46.6,6.6 46.6,6.9 47.4,7.6 48.4,7.6 50.4,5.6 v51.2,5.6
N$7
  Bottom 0.16: R59.2 R62.1 186.3,41.95 186.3,43 185.75,43.55 T4.1
N$8
  Bottom 0.16: R59.1 182.3,41.85 182.3,32.3 JP6.4
N$9
  Top 0.16: 140.45,15.93 R4.2 140.15,15.32 IC1.1
  Top 0.6: R4.2 140.6,14.2 138.8,12.4 135.5,12.4 135,11.9 T2.1 T2.2 T2.3
N$10
  Top 0.16: USB.9 129.04,56.34 129.6,56.9 141.7,56.9 142.7,55.9 145.8,55.9 146,56.1 USB2.D+
N$11
  Top 0.16: USB.8 129.68,56.08 130.1,56.5 141.4,56.5 142.5,55.5 147.3,55.5 148,56.2 USB2.D-
N$12
  Top 0.16: USB.10 128.4,55 127.9,55.5 125.4,55.5 125,55.9 USB1.D-
N$13
  Top 0.16: IC1.8 132.53,15.32 132.3,15.1 132.3,13.2 131.2,12.1 T2.4
N$14
  Top 0.16: IC1.4 138.25,18.6 R3.2
N$15
  Top 0.16: USB.11 127.76,54.94 127.6,55.1 124,55.1 123,56.1 USB1.D+
N$16
  Top 0.3: 127.76,46.39 C34.2 | USB.17 USB.18 USB.19 | USB.26 132.88,49.52 132.7,49.7 129.7,49.7 | 129.7,49.7 128.4,49.7 | USB.21 129.68,49.68 129.7,49.7
  Top 0.35: USB.18 127.76,46.39 | USB.19 128.4,49.7 126.48,51.62 USB.13
N$17
  pour Top (no thermals): 122,4 139,4 139,17 122,17
N$18
  Top 0.3: 134.16,46.61 C33.2
  Top 0.35: USB.12 127.12,51.88 128.7,50.3 133.5,50.3 134.16,49.64 USB.28 134.16,46.61
N$19
  Top 0.16: IC1.5 134.62,17.27 136.4,15.5 136.4,14.35 C5.1
N$20
  Top 0.16: IC4.6 109.65,15.15 109.3,15.5 108.35,15.5 C17.1
N$21
  Top 0.3: USB.14 124.8,54 124.6,53.8 123.55,53.8 R50.2
N$22
  Top 0.16: R22.2 R23.2 IC4.4
N$23
  Top 0.16: USB.2 133.52,54.92 133.7,55.1 135.6,55.1 136.3,54.4 136.3,53.9 137.9,52.3 X9.P$1 137.95,48.65 C31.2
N$24
  Top 0.16: C18.2 108,32.5 108.4,32.1 110.7,32.1 111.2,32.6
  Top 0.6: IC5.2 111,32.8 111.2,32.6 112.1,31.7 U$4.P$1
N$25
  Top 0.16: IC5.6 108.1,36.15 C18.1
N$26
  Top 0.16: USB.3 132.88,55.08 133.3,55.5 135.8,55.5 136.6,54.7 X9.P$2 137.95,54.65 C37.2
N$27
  Top 0.6: R65.1 121.3,54.1 117.5,57.9 114.1,57.9 112,60 C45.+ 112,63.9 113.3,65.2 125.2,65.2 127.5,62.9 USB1.VBUS 127.55,58 133.6,58 135.5,59.9 C46.+ 135.5,63.9 136.6,65 148.5,65 150.5,63 USB2.VBUS
N$28
  Top 0.16: IC7.2 49.2,6.2 47.9,6.2 46.8,7.3 45.4,7.3 45.05,7.65 U$2.27
N$29  (via drill 2.8 pad 5.5)
  other vias: 96.5,28.5
N$30
  Top 0.16: IC10.6 56.65,65.65 57.7,66.7 R56.2
N$31
  Top 0.16: IC10.4 57.25,62.75 57.5,63 57.5,64.5 57.7,64.7 R57.2
N$32
  Top 0.16: R56.1 R64.1 C43.2 63.3,64.7 63.5,64.5 63.5,62 64.5,61 86.6,61 88.7,58.9 88.7,56.4 88.6,56.3 86.2,56.3 85.5,57 U$12.T2
N$33
  Top 0.16: R57.1 C41.2 R63.1 62.45,62.45 64.3,60.6 86,60.6 87.5,59.1 87.5,58.1 87.4,58 87.4,57.6 U$12.T1
N$34
  Top 0.16: JP7.TIP 96.5,58.6 99.2,55.9 C47.-
N$35
  Top 0.16: JP7.RING 106.5,58.2 107,57.7 C48.-
N$36
  Top 0.16: U$11.1 101.2,48.6 100.9,48.3 R60.2 100.05,51.05 C47.+
N$37
  Top 0.16: R61.2 109.39,47.34 U$11.7 107.77,47.3 106.2,47.3 105.7,47.8 105.7,50.7 106,51 C48.+
N$38  (via drill 0.4)
  Top 0.16: U$11.3 104.44,46.06 v105.7,44.8 U$11.5 | v110.9,43.8 113.1,43.8 113.7,44.4 113.7,47 114.3,47.6 C32.+ 116.2,47.6 117.1,46.7 118.55,46.7 R45.2 R44.1
  Bottom 0.16: v105.7,44.8 109.9,44.8 v110.9,43.8
N$39
  Top 0.16: U$11.2 101.33,47.34 101,47 101,46.1 100.8,45.9 R54.2 97.95,48 R60.1
N$40
  Top 0.16: U$11.6 108.56,46.06 109.2,46.7 112.1,46.7 | R55.2 112.15,45.65 112.1,45.7 112.1,46.7 | 112.1,46.7 112.1,47.95 R61.1
N$41
  Top 0.16: C39.+ 82.7,52.5 84,53.8 86.1,53.8 87.1,52.8 95.2,52.8 95.7,52.3 95.7,46.7 96.5,45.9 R54.1
N$42
  Top 0.16: C36.+ 86,52.5 86.1,52.4 95,52.4 95.3,52.1 95.3,46.1 97.8,43.6 109.7,43.6 110.1,44 110.1,45.95 R55.1
N$43
  Top 0.16: U$12.W2 83.5,56.9 84.5,55.9 84.5,55.6 C36.-
N$44
  Top 0.16: U$12.W1 C39.-
N$45  (via drill 2.8 pad 5.5)
  other vias: 218.5,54.5
N$46
  Top 0.9: MOD1.ANT 152.95,28.05 arc90 154.9,30 ANT1.1
N$47
  Top 0.3: C38.2 R53.1 67.2,58.95 67.2,57.6 68,56.8 R52.1
N$48
  Top 0.16: IC5.4 111.95,36.65 111.1,37.5 111.1,37.95 R24.2 R25.2
N$49
  Top 0.16: C19.2 128,35.5 125.7,37.8 U$5.P$1
  Top 0.6: IC6.2 125.2,34.8 124.1,35.9 U$5.P$1
N$50
  Top 0.16: IC6.6 128,31.65 C19.1
N$51  (via drill 0.4)
  Top 0.16: U$2.34 45.05,11.15 45.1,11.1 53.6,11.1 56.3,13.8 v68.8,13.8
  Bottom 0.16: JP2.1 67.33,12.33 v68.8,13.8
N$52  (via drill 2.8 pad 5.5)
  other vias: 161.5,28.5
N$53
  Top 0.16: IC6.4 R27.2 R26.2
N$54
  Top 0.3: IC3.3 53.45,14.7 C4.1 53.55,14.7 54.8,14.7 55.1,15 R7.2
N$55  (via drill 0.4)
  Top 0.16: U$2.37 43.05,13.55 43.6,13 45.8,13 46.4,13.6 55.5,13.6 56.1,14.2 62,14.2 v62.3,14.5
  Bottom 0.16: JP2.3 62.25,14.45 v62.3,14.5
N$56  (via drill 2.8 pad 5.5)
  other vias: 153.5,54.5
N$57
  Top 0.16: R8.2 D2.A 154.59,11.01 T1.4
N$58
  Top 0.6: U$1.1 147.6,19.5 146.6,20.5 144.4,20.5 144,20.9 PTC1.P$2
N$59
  Top 0.16: IC10.1 53.65,64.65 53.5,64.8 53.5,66.4 53.2,66.7 R46.1 50.45,64.7 R48.2
N$60
  Top 0.16: IC10.3 53.55,62.75 53.4,62.6 53.4,60.9 53.3,60.8 R47.1 52.25,60.8 R49.2
N$61
  Top 0.16: 27,42.5 arc-180 36,42.5 arc-180 27.5,42.5 arc-180 35.5,42.5 arc-180 28,42.5 arc-180 35,42.5 arc-180 28.5,42.5 arc-180 34.5,42.5 arc-180 29,42.5 arc-180 34,42.5 arc-180 29.5,42.5 arc-180 33.5,42.5 arc-180 30,42.5 arc-180 33,42.5 arc-180 30.5,42.5 arc-180 32.5,42.5 arc-180 31,42.5
N$62
  Top 0.16: C1.2 30.85,15.25 X1.P$1 31,12.1 32.95,10.15 U$2.5
N$63
  Bottom 0.16: 205.5,12.3 arc180 196.5,12.3 arc180 205,12.3 arc180 197,12.3 arc180 204.5,12.3 arc180 197.5,12.3 arc180 204,12.3 arc180 198,12.3 arc180 203.5,12.3 arc180 198.5,12.3 arc180 203,12.3 arc180 199,12.3 arc180 202.5,12.3 arc180 199.5,12.3 arc180 202,12.3 arc180 200,12.3 arc180 201.5,12.3
N$64
  Top 0.16: U$2.30 45.45,9.15 46.1,8.5 48,8.5 48.8,7.7 50.7,7.7 50.9,7.9 X5.TP
N$65  (via drill 0.4)
  Top 0.16: v50.5,4.9 55.05,4.9 IC7.5 | U$2.28 45.15,8.15 45.6,7.7 47,7.7 47.8,6.9 v48.1,6.9
  Bottom 0.16: v48.1,6.9 48.5,6.9 v50.5,4.9
N$66
  Top 0.16: U$2.29 45.25,8.65 45.8,8.1 47.8,8.1 49,6.9 IC7.1 52.51,6.91 52.8,7.2 52.8,8.55 R9.2
N$67
  Top 0.16: U$2.31 45.55,9.65 46.3,8.9 49,8.9 X6.TP
N$68
  Top 0.16: U$2.15 38.25,3.55 37.8,3.1 37.2,3.1 X2.TP
N$69  (via drill 0.4)
  Top 0.16: U$2.44 39.25,14.75 v39.5,14.9 | v42.5,15.7 43.1,14.9 44.7,14.9 44.9,14.7 R2.1
  Bottom 0.16: v39.5,14.9 41.7,14.9 v42.5,15.7
N$70  (via drill 0.4)
  Top 0.16: v75.2,49.7 75.2,49.2 74.9,48.9 R19.2
  Bottom 0.16: v75.2,49.7 76.1,50.6 93.1,50.6 94.27,49.43 LED1.K
N$71  (via drill 0.4)
  Top 0.16: v75.8,48.8 75.8,47.8 74.8,46.8 R20.2
  Bottom 0.16: v75.8,48.8 75.8,49.3 76.7,50.2 92.8,50.2 93.3,49.7 93.3,48.5 94.27,47.53 LED2.K
N$72  (via drill 0.4)
  Top 0.16: v77.2,52.6 77.2,52.9 75.6,54.5 70.8,54.5 70.3,54 57,54 56.5,54.5 55.54,54.5 U$10.10
  Bottom 0.16: v77.2,52.6 77.6,52.2 91.5,52.2 91.73,52.43 LED4.A
N$73  (via drill 0.4)
  Top 0.16: v76.4,52.1 76.4,52.8 75.1,54.1 71,54.1 70.5,53.6 56.7,53.6 56.4,53.9 55.54,53.9 U$10.9
  Bottom 0.16: v76.4,52.1 76.7,51.8 91.7,51.8 92.8,52.9 92.8,58.9 92.7,59 LED3.A
N$74  (via drill 0.4)
  Top 0.16: U$2.7 36.65,9.15 37.2,9.7 v40.7,9.7 | v46.6,9.6 46.7,9.7 55.8,9.7 56.3,9.2 64.1,9.2 64.8,9.9 | 64.8,9.9 JP2.2 | R1.1 69.35,10.95 67.8,9.4 65.3,9.4 64.8,9.9
  Bottom 0.16: v40.7,9.7 46.5,9.7 v46.6,9.6
N$75
  Top 0.16: R30.2 19.3,50.8 20.95,52.45 21.35,52.8 44.1,52.8 45.1,51.8 46.7,51.8 47.4,51.1 47.9,51.1 48.38,50.62 U$10.17
N$76
  Top 0.16: R31.2 19.5,48.9 19.7,49.1 19.7,50.6 21.5,52.4 43.9,52.4 44.9,51.4 46.5,51.4 47.2,50.7 47.7,50.7 48.42,49.98 U$10.18
N$77
  Top 0.16: U$10.13 48.33,53.23 48.3,53.2 19.8,53.2 19.3,52.7 R28.2
N$78
  Top 0.16: U$10.12 48.38,53.88 48.1,53.6 20.4,53.6 19.3,54.7 R29.2
N$79
  Top 0.16: U$2.16 38.75,2.65 X3.TP
N$80
  Top 0.16: U$2.17 39.25,3.05 X4.TP
N$81
  Top 0.16: U$2.38 42.25,15.05 41.8,15.5 41.8,16.2 42,16.4 42.8,16.4 X7.TP
N$82
  Top 0.16: U$2.39 41.75,14.95 41.4,15.3 41.4,16.8 X8.TP
N$83  (via drill 0.4)
  Top 0.16: U$10.19 47.67,49.33 v46.5,50.5
  Bottom 0.16: v46.5,50.5 46.8,50.8 46.8,59 46,59.8 35.5,59.8 35,59.3 35,57.61 JP5.1
N$84  (via drill 0.4)
  Top 0.16: U$10.20 47.42,48.67 v45.6,50.5
  Bottom 0.16: v45.6,50.5 46.4,51.4 46.4,58.8 45.8,59.4 40.4,59.4 40.1,59.1 JP5.3
N$85  (via drill 0.4)
  Top 0.16: U$10.4 51.52,50.62 v51.1,50.2 | JP5.2 37.6,57.63 v37.6,60.5 36.35,59.25 R41.1
  Bottom 0.16: v51.1,50.2 48.3,50.2 47.2,51.3 47.2,59.2 46.2,60.2 37.9,60.2 v37.6,60.5
N$86
  Top 0.6: JP1.1 129.26,21.16 128.9,20.8 PTC2.P$1
N$89  (via drill 0.4)
  Top 0.16: U$10.3 56.92,49.98 57.6,49.3 57.6,44.1 60.2,41.5 62.9,41.5 | 62.9,41.5 67,41.5 67.6,40.9 67.6,40.4 68.8,39.2 68.8,33.2 68.8,32.9 69.9,31.8 70.2,31.8 92.7,31.8 v93.2,31.4 | v93.2,34.1 96.3,34.1 96.8,34.6 K4.1A | R42.1 62.95,41.55 62.9,41.5
  Bottom 0.16: v93.2,31.4 v93.2,34.1
N$90
  Top 0.16: U$2.6 31.05,9.65 X1.P$2 28.45,9.6 C2.2
N$92  (via drill 0.4)
  Top 0.16: v24.3,1.1 24.3,4 23.9,4.4 23.9,6.6 24.4,7.1 24.4,8.2 23.8,8.8 23.8,12 23,12.8 20.73,12.8 IC8.3
  Bottom 0.16: U$6.POS 137,1.2 136.6,0.8 91.3,0.8 90.9,1.2 90.9,9.3 89.8,10.4 82.4,10.4 80.4,8.4 80.4,1.3 79.9,0.8 24.6,0.8 v24.3,1.1
N$94  (via drill 0.4)
  Top 0.16: v9.6,0.9 R21.2
  Bottom 0.16: U$6.N 153,6.9 150.3,4.2 150.3,1 149.7,0.4 91.1,0.4 90.5,1 90.5,9.1 89.6,10 82.6,10 80.8,8.2 80.8,1.1 80.1,0.4 10.1,0.4 v9.6,0.9
N$95  (via drill 0.4)
  Top 0.16: v75.4,51.7 75.4,52.6 75,53 R32.2
  Bottom 0.16: v75.4,51.7 75.7,51.4 91.9,51.4 93.2,52.7 93.2,58.9 93.3,59 LED3.K
N$96  (via drill 0.4)
  Top 0.16: v75.3,50.7 75.1,50.7 74.8,51 R33.2
  Bottom 0.16: v75.3,50.7 75.6,51 92.1,51 93.6,52.5 93.6,53.4 94.2,54 LED4.K
N$97
  Top 0.16: K3.2B 75.75,42.25 75.3,41.8 R18.2
N$98
  Top 0.16: IC8.2 22.14,11.56 22.5,11.2 22.5,8 Q1.4
N$99
  Top 0.16: IC8.1 20.7,8 20.5,7.8 19.05,7.8 Q1.1
N$100
  Top 0.16: K2.2A 75.75,45.75 75.5,45.5 75.5,44.3 75.2,44 R17.2
N$103
  Top 0.16: TFT1.3 193.6,54.4 193.8,54.6 195.7,54.6 195.9,54.4 195.9,30.6 187.3,22 170,22 JP6.5
N$106  (via drill 0.4)
  Top 0.4: v185.6,48.7 TFT1.13 | TFT1.14 TFT1.13 | TFT1.13 TFT1.12 TFT1.11
  Bottom 0.4: T4.3 184.8,47.9 v185.6,48.7
N$108
  Top 0.16: IC1.3 136.18,16.62 134.2,18.4 132.6,18.4 132.4,18.6 131.6,18.6 130.9,17.9 126.2,17.9 125.9,18.2 R5.1
N$110
  Top 0.6: 136.6,37.45 C30.2 136.6,37.55
  Top 0.8: MOD1.3V3 139.42,35.58 137.7,37.3 136.75,37.3 C30.2
  Top 1: R36.2 136.6,37.45
N$111
  Top 0.16: IC9.3 60.75,48.95 61,49.2 65.1,49.2 65.3,49 65.3,48.05 R35.2 R34.1
N$112
  Top 0.16: C3.1 65.15,45.25 IC2.3 R6.1
N$113
  Top 0.16: U$10.1 55.52,47.33 R40.1
N$114
  Top 0.6: T1.6 T1.5 146.6,12.9 147.6,13.9 D1.C 145.6,15.8 D3.A 143.7,17.3 144,17.6 PTC1.P$1 | T1.6 T1.7 | T1.7 T1.8 | 146.56,9.7 T1.6 | T1.7 144.24,8.46 144.1,8.6 T3.4
N$115  (via drill 0.4)
  Top 0.4: TFT1.10 v188,48.2
  Bottom 0.6: v188,48.2 R58.1
N$116  (via drill 0.4)
  Top 0.4: TFT1.9 188.8,44.2 v189.4,43.6
  Bottom 0.16: 188.6,41.75 R62.2
  Bottom 0.6: v189.4,43.6 189.4,42.85 R62.2 | 188.6,41.75 188.6,39.6 188.5,39.5 188.5,29.3 168.2,9 JP6.2
N$117  (via drill 0.4)
  Top 0.4: TFT1.1 v195.2,47 | TFT1.8 189.6,47.5 v190.1,47
  Bottom 0.4: T4.2 183.85,45.35 184.2,45.7 189.1,45.7 189.3,45.9 189.3,46.6 189.7,47 v190.1,47
  Bottom 0.6: v195.2,47 v190.1,47 190.5,46.6 190.5,29.9 167.6,7 JP6.1
N$118  (via drill 0.4)
  Top 0.16: TFT1.6 191.2,30.7 186.7,26.2 170.8,26.2 v170.7,26.1
  Bottom 0.16: v170.7,26.1 170.7,22.4 165.3,17 JP6.6
N$119  (via drill 0.4)
  Top 0.16: TFT1.5 192,30.5 186.8,25.3 v169.3,25.3
  Bottom 0.16: v169.3,25.3 169.3,24 164.3,19 JP6.7
N$120  (via drill 0.4)
  Top 0.16: TFT1.4 192.8,30.2 187,24.4 v167.8,24.4
  Bottom 0.16: JP6.8 164.4,21 v167.8,24.4
N$121
  Top 0.16: TFT1.2 194.4,30.4 187,23 JP6.9
PWM0  (via drill 0.4)
  Top 0.16: R47.2 49.3,60.8 48.8,61.3 48.8,65.5 48.1,66.2 23,66.2 16.8,60 1.7,60 0.9,59.2 v0.9,42 | U$9.12 1.53,23.07 0.9,23.7 0.9,36.5 1.2,36.8 v1.2,37
  Bottom 0.16: v1.2,37 1.2,37.3 0.9,37.6 v0.9,42
PWM1  (via drill 0.4)
  Top 0.16: R46.2 22.9,66.7 16.9,60.7 v16.2,60.7 | U$9.33 4.77,51.03 3.5,52.3 3.5,57.1 3.7,57.3 12.1,57.3 14.1,59.3 v15.5,59.3
  Bottom 0.16: v16.2,60.7 16.2,60 v15.5,59.3
R_SCL  (via drill 0.4)
  Top 0.16: R10.1 12.35,12.6 v13.5,12.6 13.73,12.84 IC8.6
  Bottom 0.16: U$9.5 6.25,15.45 7.6,14.1 12.9,14.1 13.5,13.5 v13.5,12.6
R_SDA  (via drill 0.4)
  Top 0.16: R11.1 12.35,14.5 v13.5,14.5 13.89,14.11 IC8.5
  Bottom 0.16: U$9.3 4.59,12.91 3.5,14 3.5,16 4.2,16.7 5.6,16.7 7.8,14.5 v13.5,14.5
RPG1
  Top 0.16: U$9.35 14.45,53.55 15.3,52.7 R28.1
RPG2
  Top 0.16: U$9.37 4.81,56.09 6.2,54.7 R29.1
RPRX  (via drill 0.4)
  Top 0.16: v8.3,48.1 8.7,48.1 11.4,50.8 R30.1
  Bottom 0.16: U$9.10 2.33,20.53 3.5,21.7 3.5,46.7 4,47.2 7.4,47.2 v8.3,48.1
RPTX
  Top 0.16: U$9.8 0.4,19.82 0.4,39 1,39.6 2.9,39.6 3.4,40.1 3.4,46.7 3.9,47.2 8.4,47.2 10.1,48.9 R31.1
RST
  Top 0.16: JP4.9 98,22.5 95.3,19.8 80.7,19.8 79.5,21 18,21 17.4,21.6 16.8,21.6 16.4,21.2 15,21.2 14.8,21 12.4,21 12.3,21.1 10.7,21.1 7.7,24.1 7.7,34.2 7.4,34.5 3.5,34.5 U$9.22
SCK
  Top 0.16: JP4.5 97.4,15 96.5,15.9 82.2,15.9 78.7,19.4 15.1,19.4 14.4,20.1 13.55,20.1 R37.1
SCK_R
  Top 0.16: U$9.23 8.09,38.31 8.5,37.9 8.5,24.6 10.85,22.25 R37.2
SDA  (via drill 0.4)
  Top 0.16: JP4.6 81.7,17 78.9,19.8 15.8,19.8 15.2,20.4 v15.1,20.4 | U$9.19 6.87,33.23 7.3,32.8 7.3,23.9 10.6,20.6 11.8,20.6 11.9,20.5 v11.9,20.4
  Bottom 0.16: v11.9,20.4 v15.1,20.4
V25A
  Top 0.16: 56.5,60.75 C42.2 56.4,60.85
  Top 0.3: IC11.2 59.35,60.75 59.3,60.7 57.3,60.7 57.25,60.75 56.5,60.75 | IC10.5 56,63.7 55.8,63.5 55.8,62.3 56.4,61.7 56.4,60.85
V50A  (via drill 0.4)
  Top 0.16: R44.2 114.25,50.75 C44.+
  Top 0.3: IC11.3 62,59.8 62.1,59.7 C40.2 62.35,59 R53.2 65.05,59.85 65.3,60.1 77.1,60.1 v77.3,59.9 | v77.3,61.7 77.3,61.5
  Top 0.4: 77.3,61.5 87.1,61.5 90.6,58 94.5,58 99.3,53.2 113.7,53.2 114,52.9 C44.+ 113.8,50.8 109.8,50.8 109,50 109,49.1 108.5,48.6 U$11.8
  Bottom 0.3: v77.3,59.9 v77.3,61.7
VCC  (via drill 0.4, 0.7)
  Top 0.16: v83,9.2 82.7,9.4 74.2,9.4 69.6,4.8 v69.6,4.3 | 56.3,4.2 67.2,4.2 68,5 v68,5.4 68,7.5 69.35,8.85 R1.2 | 56.3,4.2 44.1,4.2 44,4.3 C10.1 | 56.3,4.2 56.3,6.7 56.09,6.91 IC7.8 55.1,8.45 R9.1 54.85,8.4 v59.5,8.4 | R12.2 R13.2 R14.2 R15.2 53.85,34.75 53.4,34.3 49.9,34.3 49,33.4 v49,24.8 49.3,24.5 68.5,24.5 71.1,27.1 v71.1,30.3 | v46,17.7 46,17.2 46.65,16.55 | R17.1 R18.1 R16.1 72,39.15 72,36.8 71.1,35.9 v71.1,34.1
  Top 0.3: 37.25,12.15 U$2.1 | 37.25,12.15 U$2.48 37.25,14.85 C9.1 | 46.6,12.55 46.3,12.3 46.15,12.15 U$2.36 41.35,12.15 | 46.6,12.55 C8.1 | 41.35,12.15 39.5,12.15 38.6,11.25 37.5,11.25 37.25,11.5 37.25,12.15 | U$2.9 41.4,8.15 | 41.4,8.15 41.4,12.1 41.35,12.15 | 41.4,8.15 41.9,8.15 42.75,7.3 U$2.24 C10.1 | v46.5,14.3 46.5,16.4 46.65,16.55 46.95,16.85 C6.1 47.95,16.9 IC3.2 | v46.5,12.7 46.6,12.55
  Bottom 0.16: VDD.TP v83,9.2 | v69.6,4.3 69.1,4.3 v68,5.4 | JP2.4 59.71,8.61 v59.5,8.4 | v49,24.8 49,20.7 v46,17.7 | v71.1,34.1 71.1,34 72.4,32.7 72.4,31.7 71.1,30.4 v71.1,30.3
  Bottom 0.3: v46.5,14.3 v46.5,12.7
VDD  (via drill 0.4)
  Top 0.16: v9,10.6 9,12.2 9.3,12.5 R10.2 R11.2
  Top 0.4: JP4.2 97.4,9 91.4,15 81.8,15 78.3,18.5 8.9,18.5 6.9,16.5 6.9,10.8 6.5,10.4 4.8,10.4 U$9.1 | v9,10.6 9.25,10.35 C23.1 11.65,10.29 IC8.8
  Bottom 0.4: v9,10.6 5,10.6 U$9.1
WL_D+
  Top 0.16: USB.7 130.32,52.38 131.9,50.8 133.7,50.8 134.7,49.8 134.7,47.3 135,47 135,44 136.6,42.4 140.2,42.4 140.9,41.7 140.9,33.7 140.5,33.3 138.5,33.3 138.3,33.1 138.3,30.7 139.6,29.4 MOD1.D+
WL_D-
  Top 0.16: USB.6 130.96,52.44 132.2,51.2 133.9,51.2 135.1,50 135.1,47.5 135.4,47.2 135.4,44.2 136.8,42.8 140.4,42.8 141.3,41.9 141.3,33.2 140.6,32.5 MOD1.D-
(copper drawn outside any net)
  shapes: Top circle x4

## Text on the board
Top: pzc A, display board. v 1.0 | pzc A. v 1.1